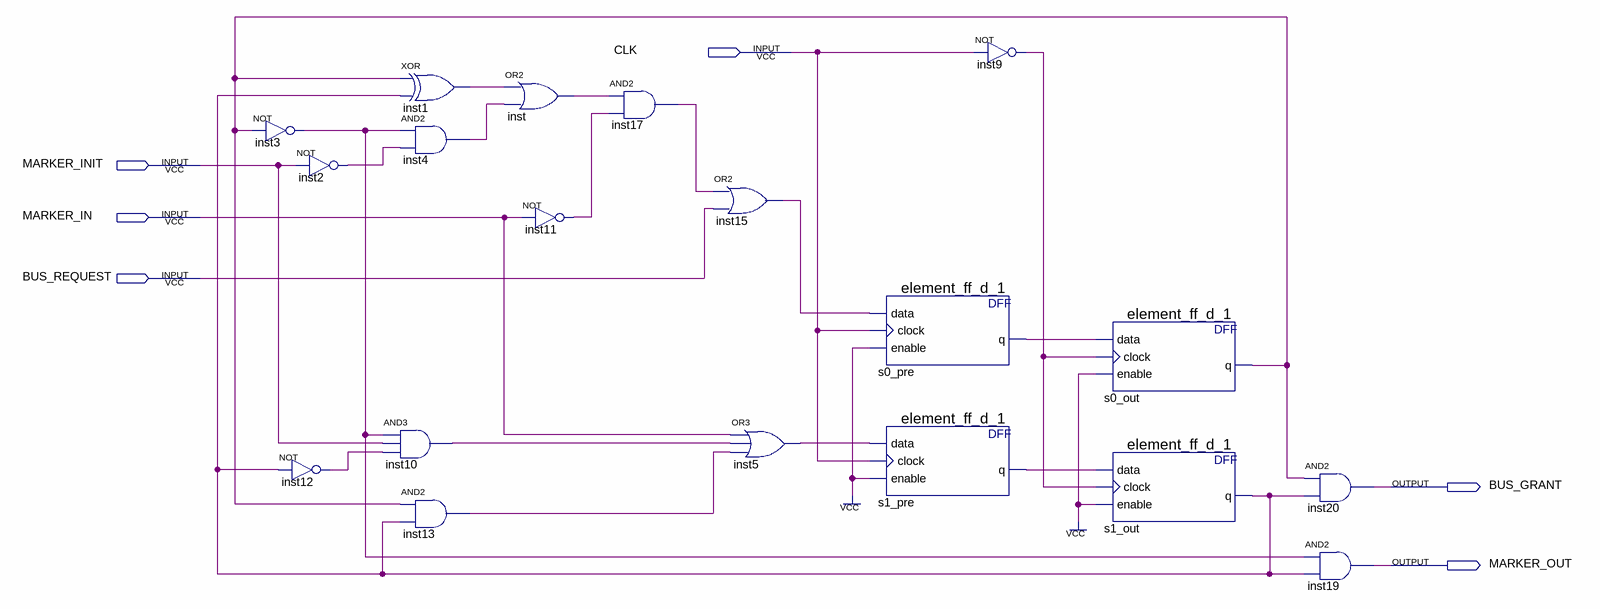
[diagram p0: schematic sheet]
// Quartus schematic block-bus-arbiter-unit.bdf as structural Verilog: 19 symbols, 6 pins
module \block-bus-arbiter-unit  (
  input  CLK,
  input  MARKER_INIT,
  input  MARKER_IN,
  input  BUS_REQUEST,
  output BUS_GRANT,
  output MARKER_OUT
);

  wire inst1_out, inst2_out, inst3_out, inst4_out, inst5_out, inst9_out, inst10_out, inst11_out, inst12_out,
       inst13_out, inst15_out, inst17_out, inst_out, s0_out_q, s0_pre_q, s1_out_q, s1_pre_q;

  not inst3 (inst3_out, s0_out_q);
  not inst2 (inst2_out, MARKER_INIT);
  not inst12 (inst12_out, s1_out_q);
  xor inst1 (inst1_out, s0_out_q, s1_out_q);
  and inst4 (inst4_out, inst3_out, inst2_out);
  and inst10 (inst10_out, inst3_out, MARKER_INIT, inst12_out);
  and inst13 (inst13_out, s0_out_q, s1_out_q);
  or inst (inst_out, inst1_out, inst4_out);
  not inst11 (inst11_out, MARKER_IN);
  and inst17 (inst17_out, inst_out, inst11_out);
  or inst15 (inst15_out, inst17_out, BUS_REQUEST);
  or inst5 (inst5_out, MARKER_IN, inst10_out, inst13_out);
  element_ff_d_1 s0_pre (.data(inst15_out), .clock(CLK), .enable(1'b1), .q(s0_pre_q));
  element_ff_d_1 s1_pre (.data(inst5_out), .clock(CLK), .enable(1'b1), .q(s1_pre_q));
  not inst9 (inst9_out, CLK);
  element_ff_d_1 s0_out (.data(s0_pre_q), .clock(inst9_out), .enable(1'b1), .q(s0_out_q));
  element_ff_d_1 s1_out (.data(s1_pre_q), .clock(inst9_out), .enable(1'b1), .q(s1_out_q));
  and inst20 (BUS_GRANT, s0_out_q, s1_out_q);
  and inst19 (MARKER_OUT, inst3_out, s1_out_q);
endmodule
